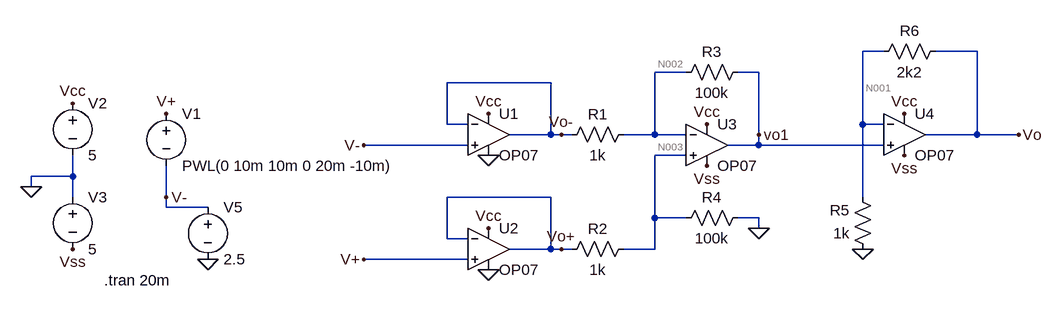
[diagram p0: schematic Draft1.asc]
Draft1.asc, the LTspice schematic file:
Version 4.1
SHEET 1 1128 1016
WIRE 736 240 704 240
WIRE 880 240 816 240
WIRE 432 272 384 272
WIRE 544 272 512 272
WIRE 224 288 64 288
WIRE 64 352 64 288
WIRE 96 352 64 352
WIRE 704 352 704 240
WIRE 736 352 704 352
WIRE 224 368 224 288
WIRE 224 368 160 368
WIRE 240 368 224 368
WIRE 256 368 240 368
WIRE 384 368 384 272
WIRE 384 368 336 368
WIRE 432 368 384 368
WIRE 544 368 544 272
WIRE 880 368 880 240
WIRE 880 368 800 368
WIRE 944 368 880 368
WIRE 96 384 -64 384
WIRE 544 384 544 368
WIRE 544 384 496 384
WIRE 736 384 544 384
WIRE 432 400 384 400
WIRE -512 432 -512 400
WIRE -512 432 -576 432
WIRE -576 448 -576 432
WIRE -512 464 -512 432
WIRE -368 464 -368 416
WIRE 224 464 64 464
WIRE 704 464 704 352
WIRE -368 480 -368 464
WIRE -304 480 -368 480
WIRE 384 496 384 400
WIRE 432 496 384 496
WIRE 544 496 512 496
WIRE 544 512 544 496
WIRE 64 528 64 464
WIRE 96 528 64 528
WIRE 224 544 224 464
WIRE 224 544 160 544
WIRE 240 544 224 544
WIRE 256 544 240 544
WIRE 384 544 384 496
WIRE 384 544 336 544
WIRE 96 560 -64 560
FLAG 544 512 0
FLAG 944 368 Vo
FLAG 128 336 Vcc
FLAG 464 352 Vcc
FLAG 768 336 Vcc
FLAG 464 416 Vss
FLAG 128 512 Vcc
FLAG -576 448 0
FLAG -512 320 Vcc
FLAG -512 544 Vss
FLAG -304 560 0
FLAG -368 464 V-
FLAG -368 336 V+
FLAG 768 400 Vss
FLAG -64 560 V+
FLAG -64 384 V-
FLAG 240 544 Vo+
FLAG 240 368 Vo-
FLAG 544 368 vo1
FLAG 704 544 0
FLAG 128 400 0
FLAG 128 576 0
SYMBOL OpAmps\\OP07 128 304 R0
SYMATTR InstName U1
SYMBOL OpAmps\\OP07 128 480 R0
SYMATTR InstName U2
SYMBOL res 352 352 R90
WINDOW 0 0 56 VBottom 2
WINDOW 3 32 56 VTop 2
SYMATTR InstName R1
SYMATTR Value 1k
SYMBOL res 352 528 R90
WINDOW 0 0 56 VBottom 2
WINDOW 3 32 56 VTop 2
SYMATTR InstName R2
SYMATTR Value 1k
SYMBOL OpAmps\\OP07 464 320 R0
SYMATTR InstName U3
SYMBOL res 528 256 R90
WINDOW 0 0 56 VBottom 2
WINDOW 3 32 56 VTop 2
SYMATTR InstName R3
SYMATTR Value 100k
SYMBOL res 528 480 R90
WINDOW 0 0 56 VBottom 2
WINDOW 3 32 56 VTop 2
SYMATTR InstName R4
SYMATTR Value 100k
SYMBOL OpAmps\\OP07 768 304 R0
SYMATTR InstName U4
SYMBOL res 720 560 R180
WINDOW 0 36 76 Left 2
WINDOW 3 36 40 Left 2
SYMATTR InstName R5
SYMATTR Value 1k
SYMBOL res 720 256 R270
WINDOW 0 32 56 VTop 2
WINDOW 3 0 56 VBottom 2
SYMATTR InstName R6
SYMATTR Value 2k2
SYMBOL voltage -512 304 R0
WINDOW 123 0 0 Left 0
WINDOW 39 0 0 Left 0
SYMATTR InstName V2
SYMATTR Value 5
SYMBOL voltage -368 320 R0
WINDOW 123 0 0 Left 0
WINDOW 39 0 0 Left 0
SYMATTR InstName V1
SYMATTR Value PWL(0 10m 10m 0 20m -10m)
SYMBOL voltage -304 464 R0
WINDOW 123 0 0 Left 0
WINDOW 39 0 0 Left 0
SYMATTR InstName V5
SYMATTR Value 2.5
SYMBOL voltage -512 448 R0
WINDOW 123 0 0 Left 0
WINDOW 39 0 0 Left 0
SYMATTR InstName V3
SYMATTR Value 5
TEXT -464 592 Left 2 !.tran 20m

The netlist it stands for:
* Draft1.asc
X§U1 V- Vo- Vcc 0 Vo- LT1001  ; OP07, pins In+ In- V+ V- OUT
X§U2 V+ Vo+ Vcc 0 Vo+ LT1001  ; OP07, pins In+ In- V+ V- OUT
R1 N002 Vo- 1k
R2 N003 Vo+ 1k
X§U3 N003 N002 Vcc Vss vo1 LT1001  ; OP07, pins In+ In- V+ V- OUT
R3 vo1 N002 100k
R4 0 N003 100k
X§U4 vo1 N001 Vcc Vss Vo LT1001  ; OP07, pins In+ In- V+ V- OUT
R5 0 N001 1k
R6 N001 Vo 2k2
V2 Vcc 0 5
V1 V+ V- PWL(0 10m 10m 0 20m -10m)
V5 V- 0 2.5
V3 0 Vss 5
.tran 20m
.lib LTC.lib
.backanno
.end

* Results of the author's LTspice run, read from the files saved beside the schematic
* Operating Point, zero values left out:
*   V(vo-) = 2.5 V
*   V(v+) = 2.51 V
*   V(vo+) = 2.51 V
*   V(n003) = 2.485 V
*   V(n001) = 999.9 mV
*   V(v-) = 2.5 V
*   V(vcc) = 5 V
*   V(n002) = 2.485 V
*   V(vss) = -5 V
*   V(vo1) = 999.9 mV
*   V(vo) = 3.2 V
*   I(R2) = -24.85 µA
*   I(R3) = -14.85 µA
*   I(V2) = -9.54 mA
*   I(V3) = -4.035 mA
*   I(R4) = -24.85 µA
*   I(R5) = -999.9 µA
*   I(R6) = -999.9 µA
*   I(R1) = -14.85 µA